# EAGLE design RoboSkinRev2 (EAGLE 9.4.2)
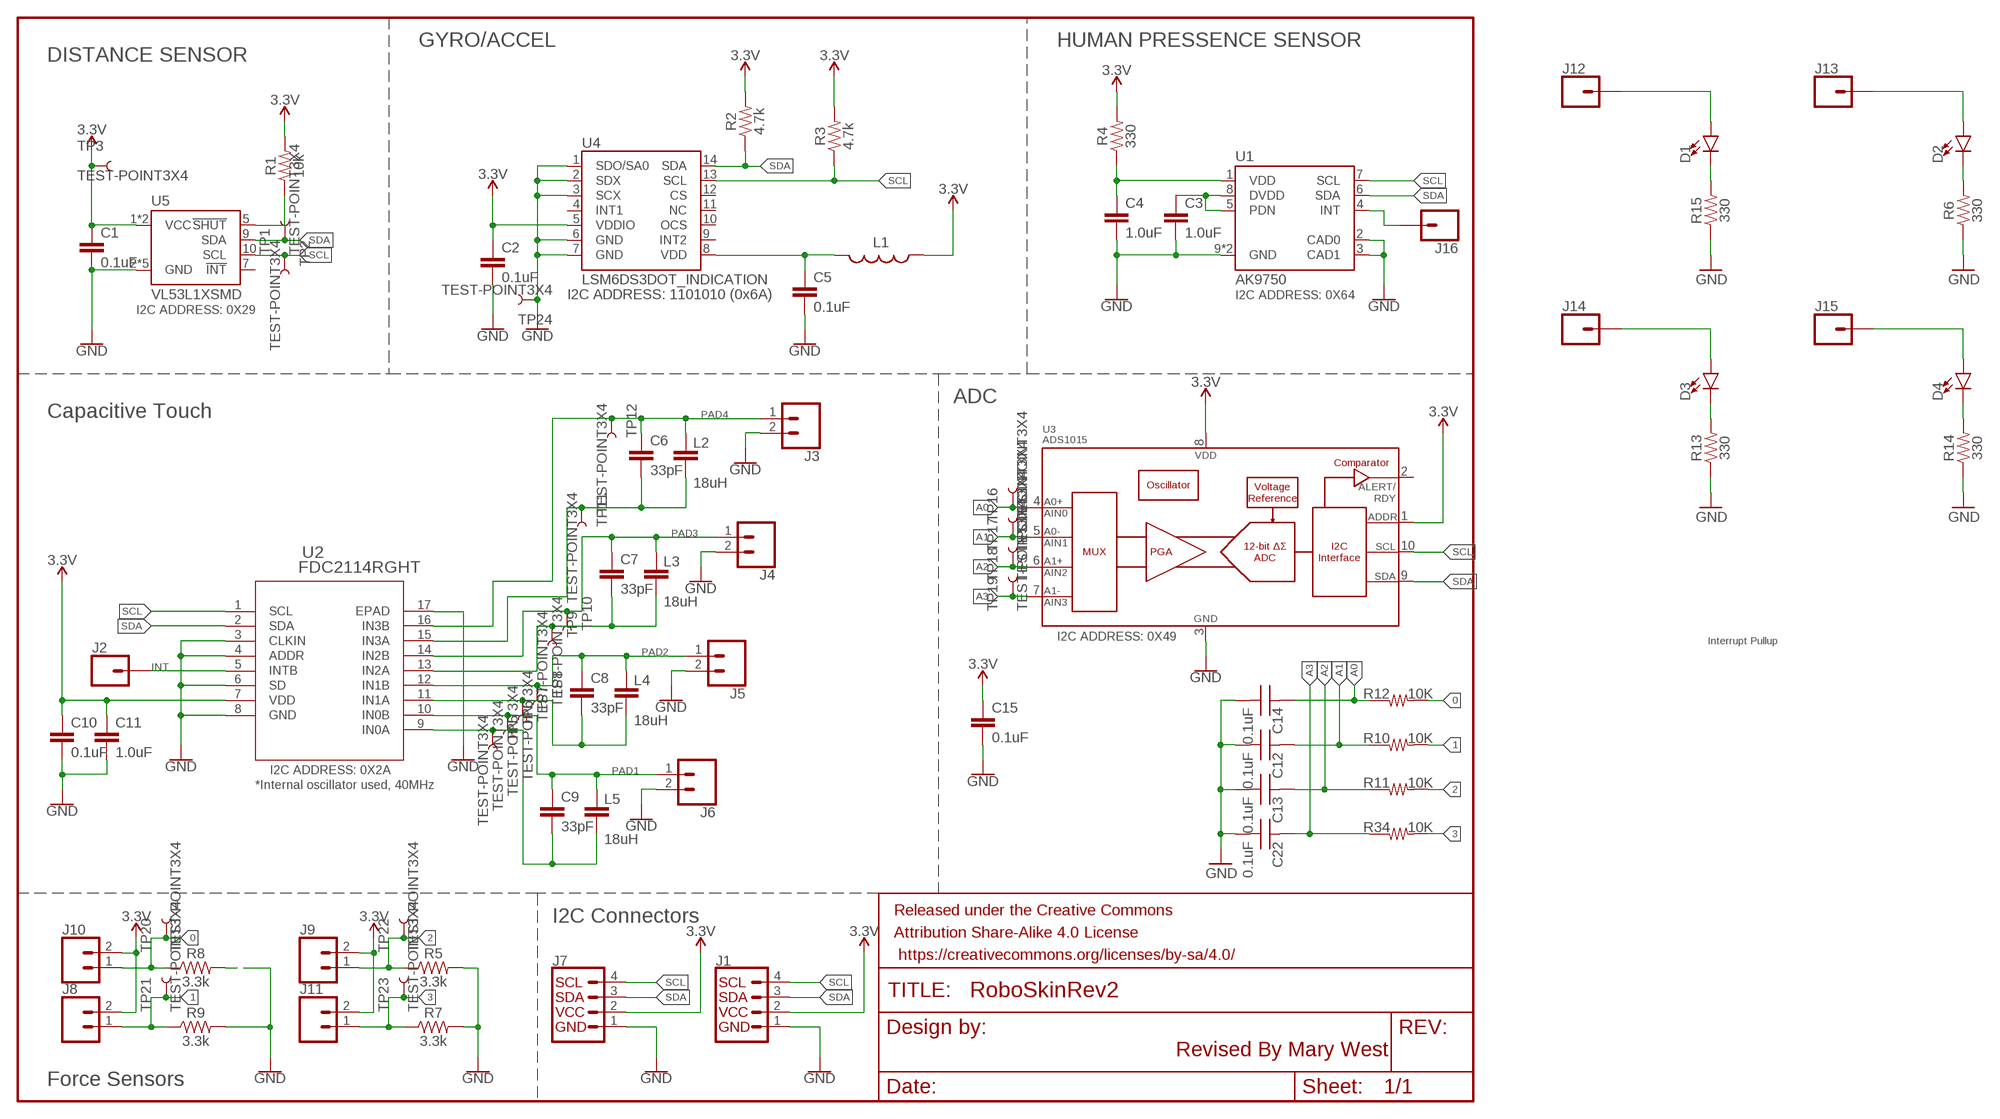
[diagram p0: schematic, sheet 1]

## Parts
C1  0.1uF  0.1UF-0603-25V-(+80/-20%)  [0603]
C2  0.1uF  0.1UF-0603-25V-(+80/-20%)  [0603]
C3  1.0uF  1.0UF-0603-16V-10%  [0603]
C4  1.0uF  1.0UF-0603-16V-10%  [0603]
C5  0.1uF  0.1UF-0603-25V-(+80/-20%)  [0603]
C6  33pF  33PF-0603-50V-5%  [0603]
C7  33pF  33PF-0603-50V-5%  [0603]
C8  33pF  33PF-0603-50V-5%  [0603]
C9  33pF  33PF-0603-50V-5%  [0603]
C10  0.1uF  0.1UF-0603-25V-(+80/-20%)  [0603]
C11  1.0uF  1.0UF-0603-16V-10%  [0603]
C12  0.1uF  CAPACITORC_0603_SILK  [0603_SILK]
C13  0.1uF  CAPACITORC_0603_SILK  [0603_SILK]
C14  0.1uF  CAPACITORC_0603_SILK  [0603_SILK]
C15  0.1uF  0.1UF-0603-25V-(+80/-20%)  [0603]
C22  0.1uF  CAPACITORC_0603_SILK  [0603_SILK]
D1  LED1206  [LED-1206]
D2  LED1206  [LED-1206]
D3  LED1206  [LED-1206]
D4  LED1206  [LED-1206]
FRAME1  FRAME-LETTERNO_PACKAGE  [DUMMY]
J1  QWIIC_CONNECTORJS-1MM  [1X04_1MM_RA]
J2  CONN_01  [1X01]
J3  CONN_02  [1X02]
J4  CONN_02  [1X02]
J5  CONN_02  [1X02]
J6  CONN_02  [1X02]
J7  QWIIC_CONNECTORJS-1MM  [1X04_1MM_RA]
J8  CONN_02  [1X02]
J9  CONN_02  [1X02]
J10  CONN_02  [1X02]
J11  CONN_02  [1X02]
J12  CONN_01  [1X01]
J13  CONN_01  [1X01]
J14  CONN_01  [1X01]
J15  CONN_01  [1X01]
J16  CONN_01PTH_NO_SILK_YES_STOP  [1X01_NO_SILK]
L1  RES-07859  INDUCTOR30OHM,1.8A  [0603]
L2  18uH  100UF6.3V20%(1210)  [1210]
L3  18uH  100UF6.3V20%(1210)  [1210]
L4  18uH  100UF6.3V20%(1210)  [1210]
L5  18uH  100UF6.3V20%(1210)  [1210]
R1  10k  10KOHM-0603-1/10W-1%  [0603]
R2  4.7k  4.7KOHM-0603-1/10W-1%  [0603]
R3  4.7k  4.7KOHM-0603-1/10W-1%  [0603]
R4  330  330OHM-0603-1/10W-1%  [0603]
R5  3.3k  3.3KOHM-0603-1/10W-1%  [0603]
R6  330  330OHM-0603-1/10W-1%  [0603]
R7  3.3k  3.3KOHM-0603-1/10W-1%  [0603]
R8  3.3k  3.3KOHM-0603-1/10W-1%  [0603]
R9  3.3k  3.3KOHM-0603-1/10W-1%  [0603]
R10  10K  RESISTORR_0603_SILK  [0603_SILK]
R11  10K  RESISTORR_0603_SILK  [0603_SILK]
R12  10K  RESISTORR_0603_SILK  [0603_SILK]
R13  330  330OHM-0603-1/10W-1%  [0603]
R14  330  330OHM-0603-1/10W-1%  [0603]
R15  330  330OHM-0603-1/10W-1%  [0603]
R34  10K  RESISTORR_0603_SILK  [0603_SILK]
TP1  TEST-POINT3X4  [PAD.03X.04]
TP2  TEST-POINT3X4  [PAD.03X.04]
TP3  TEST-POINT3X4  [PAD.03X.04]
TP5  TEST-POINT3X4  [PAD.03X.04]
TP6  TEST-POINT3X4  [PAD.03X.04]
TP7  TEST-POINT3X4  [PAD.03X.04]
TP8  TEST-POINT3X4  [PAD.03X.04]
TP9  TEST-POINT3X4  [PAD.03X.04]
TP10  TEST-POINT3X4  [PAD.03X.04]
TP11  TEST-POINT3X4  [PAD.03X.04]
TP12  TEST-POINT3X4  [PAD.03X.04]
TP16  TEST-POINT3X4  [PAD.03X.04]
TP17  TEST-POINT3X4  [PAD.03X.04]
TP18  TEST-POINT3X4  [PAD.03X.04]
TP19  TEST-POINT3X4  [PAD.03X.04]
TP20  TEST-POINT3X4  [PAD.03X.04]
TP21  TEST-POINT3X4  [PAD.03X.04]
TP22  TEST-POINT3X4  [PAD.03X.04]
TP23  TEST-POINT3X4  [PAD.03X.04]
TP24  TEST-POINT3X4  [PAD.03X.04]
U1  AK9750  [SON10]
U2  FDC2114RGHT  [RGH16]
U3  ADS1015  [MSOP10]
U4  LSM6DS3DOT_INDICATION  [LGA14L_DOT_INDICATOR]
U5  VL53L1XSMD  [VL53L1X]

## Nets
0: J10.1 R8.1 R12.P2 TP20.P$1
1: J8.1 R9.1 R10.P2 TP21.P$1
2: J9.1 R5.1 R11.P2 TP22.P$1
3: J11.1 R7.1 R34.P2 TP23.P$1
3.3V: C1.1 C2.1 C10.1 C11.1 C15.1 J1.2(VCC) J7.2(VCC) J8.2 J9.2 J10.2 J11.2 L1.1 R1.2 R2.2 R3.2 R4.2 TP3.P$1 U2.7(VDD) U3.1(ADDR) U3.8(VDD) U4.5(VDDIO) U5.1(VCC) U5.11(VCC)
A0: C14.P1 R12.P1 TP16.P$1 U3.4(AIN0)
A1: C12.P1 R10.P1 TP17.P$1 U3.5(AIN1)
A2: C13.P1 R11.P1 TP18.P$1 U3.6(AIN2)
A3: C22.P1 R34.P1 TP19.P$1 U3.7(AIN3)
D1: D2.A J13.1
D2: D3.A J14.1
D3: D4.A J15.1
D7: D1.A J12.1
GND: C1.2 C2.2 C3.2 C4.2 C5.2 C10.2 C11.2 C12.P2 C13.P2 C14.P2 C15.2 C22.P2 J1.1(GND) J3.2 J4.2 J5.2 J6.2 J7.1(GND) R5.2 R6.1 R7.2 R8.2 R9.2 R13.1 R14.1 R15.1 TP24.P$1 U1.2(CAD0) U1.3(CAD1) U1.9(GND) U1.10(GND) U2.3(CLKIN) U2.4(ADDR) U2.6(SD) U2.8(GND) U2.17(EPAD) U3.3(VSS) U4.1(SDO/SA0) U4.2(SDX) U4.3(SCX) U4.6(GND) U4.7(GND) U5.2(GND) U5.3(GND) U5.4(GND) U5.6(GND) U5.12(GND)
INT: J2.1 U2.5(INTB)
N$1: C4.1 R4.1 U1.1(VDD)
N$2: C3.1 U1.5(PDN) U1.8(DVDD)
N$3: R1.1 U5.5(!SHUT)
N$4: D1.C R15.2
N$5: D2.C R6.2
N$6: C5.1 L1.2 U4.8(VDD)
N$7: D3.C R13.2
N$8: C6.2 L2.2 TP11.P$1 U2.15(IN3A)
N$9: D4.C R14.2
N$10: C7.2 L3.2 TP9.P$1 U2.13(IN2A)
N$11: J16.1 U1.4(INT)
N$12: C8.2 L4.2 TP7.P$1 U2.11(IN1A)
N$14: C9.2 L5.2 TP5.P$1 U2.9(IN0A)
PAD1: C9.1 J6.1 L5.1 TP6.P$1 U2.10(IN0B)
PAD2: C8.1 J5.1 L4.1 TP8.P$1 U2.12(IN1B)
PAD3: C7.1 J4.1 L3.1 TP10.P$1 U2.14(IN2B)
PAD4: C6.1 J3.1 L2.1 TP12.P$1 U2.16(IN3B)
SCL: J1.4(SCL) J7.4(SCL) R3.1 TP2.P$1 U1.7(SCL) U2.1(SCL) U3.10(SCL) U4.13(SCL) U5.10(SCL)
SDA: J1.3(SDA) J7.3(SDA) R2.1 TP1.P$1 U1.6(SDA) U2.2(SDA) U3.9(SDA) U4.14(SDA) U5.9(SDA)
Unconnected: U3.2(ALERT/RDY) U4.4(INT1) U4.9(INT2) U4.10(OCS) U4.11(NC) U4.12(CS) U5.7(!INT)

## Notes on the sheet
- GYRO/ACCEL | HUMAN PRESSENCE SENSOR
- DISTANCE SENSOR
- I2C ADDRESS: 1101010 (0x6A) | I2C ADDRESS: 0X64
- I2C ADDRESS: 0X29
- ADC
- Capacitive Touch
- I2C ADDRESS: 0X49 | Interrupt Pullup
- I2C ADDRESS: 0X2A
- *Internal oscillator used, 40MHz
- I2C Connectors
- Revised By Mary West
- Force Sensors

## Library data of the parts
C1 C2 C5 C10 C15 = SparkFun-Capacitors:0.1UF: 0.1µF ceramic capacitors A capacitor is a passive two-terminal electrical component used to store electrical energy temporarily in an electric field.; PROD_ID: CAP-00810
C3 C4 C11 = SparkFun-Capacitors:1.0UF: 1µF ceramic capacitors A capacitor is a passive two-terminal electrical component used to store electrical energy temporarily in an electric field.; PROD_ID: CAP-00868
C6-C9 = SparkFun-Capacitors:33PF: 33pF ceramic capacitors A capacitor is a passive two-terminal electrical component used to store electrical energy temporarily in an electric field.; PROD_ID: CAP-10142
C12-C14 C22 = 1_BES_Passives:CAPACITOR: SMT Capacitor; PARTNO: GRM188R70J104KA01D
D1-D4 = SparkFun-LED:LED: LED (Generic) Standard schematic elements and footprints for 5mm, 3mm, 1206, and 0603 sized LEDs. Generic LEDs with no color specified.
FRAME1 = SparkFun-Aesthetics:FRAME-LETTER: Schematic Frame - Letter Standard 8.5x11 US Letter frame; DESIGNER: Nobody; VERSION: v01
J1 J7 = SparkFun-Connectors:QWIIC_CONNECTOR: SparkFun I2C Standard Qwiic Connector An SMD 1mm pitch JST connector makes it easy and quick (get it? Qwiic?) to connect I2C devices to each other. The Qwiic system <http://www.sparkfun.com/qwiic> enables fast and solderless connection between popular platforms and various sensors and actuators. We carry 200mm <https://www.sparkfun.com/products/14204>, 100mm <https://www.sparkfun.com/products/14205>, 50mm <https://www.sparkfun.com/products/14206>, and breadboard friendly <https://www.sparkfun.com/products/14207> Qwiic cables. We also offer 10 pcs strips <https://www.sparkfun.com/products/14323> the SMD connectors.
J2 J12-J16 = SparkFun-Connectors:CONN_01: Single connection point. Often used as Generic Header-pin footprint for 0.1 inch spaced/style header connections On any of the 0.1 inch spaced packages, you can populate with these: Break Away Headers - Straight <https://www.sparkfun.com/products/116> (PRT-00116) Break Away Male Headers - Right Angle <https://www.sparkfun.com/products/553> (PRT-00553) Female Headers <https://www.sparkfun.com/products/115> (PRT-00115) Break Away Headers - Machine Pin <https://www.sparkfun.com/products/117> (PRT-00117) Break Away Female Headers - Swiss Machine Pin <https://www.sparkfun.com/products/743> (PRT-00743) This device is also useful as a general connection point to wire up your design to another part of your project. Our various solder wires solder well into these plated through hole pads. Hook-Up Wire - Assortment (Stranded, 22 AWG) <https://www.sparkfun.com/products/11375> (PRT-11375) Hook-Up Wire - Assortment (Solid Core, 22 AWG) <https://www.sparkfun.com/products/11367> (PRT-11367) View the entire wire category on our website here <https://www.sparkfun.com/categories/141> Special notes: SMTSO-256-ET is a "flush mount" nut for a 4-40 screw. We mostly use this on specialty testbeds; it is a nice way to connect hardware to your PCB at an adjustable hieght. Also note, the SNAP packages are for using a snappable style connector. We sell a baggie of snaps and they are also used on two LilyPad designs: Snap Assortment - 30 pack (male and female) <https://www.sparkfun.com/products/11347> (DEV-11347) LilyPad Arduino SimpleSnap <https://www.sparkfun.com/products/10941> (DEV-10941) LilyPad SimpleSnap Protoboard <https://www.sparkfun.com/products/10940> (DEV-10940)
J3-J6 J8-J11 = SparkFun-Connectors:CONN_02: Multi connection point. Often used as Generic Header-pin footprint for 0.1 inch spaced/style header connections On any of the 0.1 inch spaced packages, you can populate with these: Break Away Headers - Straight <https://www.sparkfun.com/products/116> (PRT-00116) Break Away Male Headers - Right Angle <https://www.sparkfun.com/products/553> (PRT-00553) Female Headers <https://www.sparkfun.com/products/115> (PRT-00115) Break Away Headers - Machine Pin <https://www.sparkfun.com/products/117> (PRT-00117) Break Away Female Headers - Swiss Machine Pin <https://www.sparkfun.com/products/743> (PRT-00743) For SCREWTERMINALS and SPRING TERMINALS visit here: Screw Terimnals on SparkFun.com <https://www.sparkfun.com/search/results?term=Screw+Terminals> (5mm/3.5mm/2.54mm spacing) This device is also useful as a general connection point to wire up your design to another part of your project. Our various solder wires solder well into these plated through hole pads. Hook-Up Wire - Assortment (Stranded, 22 AWG) <https://www.sparkfun.com/products/11375> (PRT-11375) Hook-Up Wire - Assortment (Solid Core, 22 AWG) <https://www.sparkfun.com/products/11367> (PRT-11367) View the entire wire category on our website here <https://www.sparkfun.com/categories/141> Special notes: Molex polarized connector foot print use with: PRT-08233 with associated crimp pins and housings. 2.54_SCREWTERM for use with PRT-10571. 3.5mm Screw Terminal footprints for PRT-08084 5mm Screw Terminal footprints for use with PRT-08432
L1 = SparkFun-Passives:INDUCTOR: Inductors Basic Inductor/Choke - 0603 and 1206. Footprints are not proven and vary greatly between part numbers. SRN6045- 33uH, 20% 1.4A SDR0403-560KL - 56uH, 10%, 500mA RMS/740mA peak; PROD_ID: RES-07859
L2-L5 = SparkFun-Retired:100UF6.3V20%(1210): CAP-09827; PROD_ID: CAP-09827; VALUE: 100uF
R1 = SparkFun-Resistors:10KOHM: 10kΩ resistor A resistor is a passive two-terminal electrical component that implements electrical resistance as a circuit element. Resistors act to reduce current flow, and, at the same time, act to lower voltage levels within circuits. - Wikipedia; PROD_ID: RES-00824
R2 R3 = SparkFun-Resistors:4.7KOHM: 4.7kΩ resistor A resistor is a passive two-terminal electrical component that implements electrical resistance as a circuit element. Resistors act to reduce current flow, and, at the same time, act to lower voltage levels within circuits. - Wikipedia; PROD_ID: RES-07857
R4 R6 R13-R15 = SparkFun-Resistors:330OHM: 330Ω resistor A resistor is a passive two-terminal electrical component that implements electrical resistance as a circuit element. Resistors act to reduce current flow, and, at the same time, act to lower voltage levels within circuits. - Wikipedia; PROD_ID: RES-00818
R5 R7-R9 = SparkFun-Resistors:3.3KOHM: 3.3kΩ resistor A resistor is a passive two-terminal electrical component that implements electrical resistance as a circuit element. Resistors act to reduce current flow, and, at the same time, act to lower voltage levels within circuits. - Wikipedia; PROD_ID: RES-07851
R10-R12 R34 = 1_BES_Passives:RESISTOR: Resistor, Chip Mount, SMT; PARTNO: CR0603-FX-1002ELF
TP1-TP3 TP5-TP12 TP16-TP24 = SparkFun-Connectors:TEST-POINT: SparkFun Test Points Bare copper test points for troubleshooting or In-Circuit-Testing. These are used by our Production team for verifying production board runs using pogo-pins on test beds. SparkFun Products: SparkFun LSM9DS1 Breakout <https://www.sparkfun.com/products/13284> SparkFun PSOC <https://www.sparkfun.com/products/13714> SparkFun Load Cell Amplifier <https://www.sparkfun.com/products/13879>
U1 = SparkFun-Sensors:AK9750: AK9750/AK9753 Human Movement Sensor; PROD_ID: SEN-13737
U2 = FDC2114:FDC2114RGHT; BUILT_BY: EMA_Jessica; COPYRIGHT: Copyright (C) 2018 Accelerated Designs. All rights reserved; MANUFACTURER_PART_NUMBER: FDC2114RGHT; VENDOR: Texas Instruments
U3 = SparkFun-IC-Conversion:ADS1015: ADS1015 12-BIT ADC 12-Bit Del-Sig ADC Four single-ended inputs or two differential inputs Internal PGA I2C interface 2.0-5.5V SparkFun Products SparkFun Block for Intel Edison - ADC <https://www.sparkfun.com/products/13770> (DEV-13770); PROD_ID: IC-12270
U4 = LSM6DS3:LSM6DS3; PROD_ID: IC-12969
U5 = SparkFun-Sensors:VL53L1X: STMicroelectronics VL53L1X - 400 cm IR Laser ToF Sensor VL53L1X is a state-of-the-art ToF laser-ranging sensor, enhancing the ST FlightSense product family. It is the fastest miniature ToF sensor currently on the market with accurate ranging up to 4 m and fast ranging frequency (up to 50 Hz). Housed in a miniature and reflowable package, it integrates a single photon avalanche diode (SPAD) receiving array, a 940 nm invisible laser Class 1 emitter, physical infrared filters, and optics to achieve the best ranging performance in various ambient lighting conditions with a range of cover window options.; PROD_ID: IC-13960

## Board
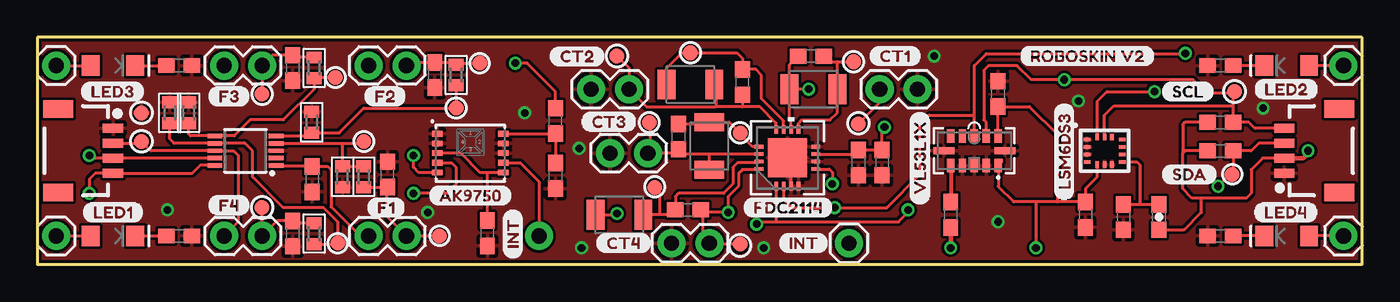
[diagram p1: board, top side]
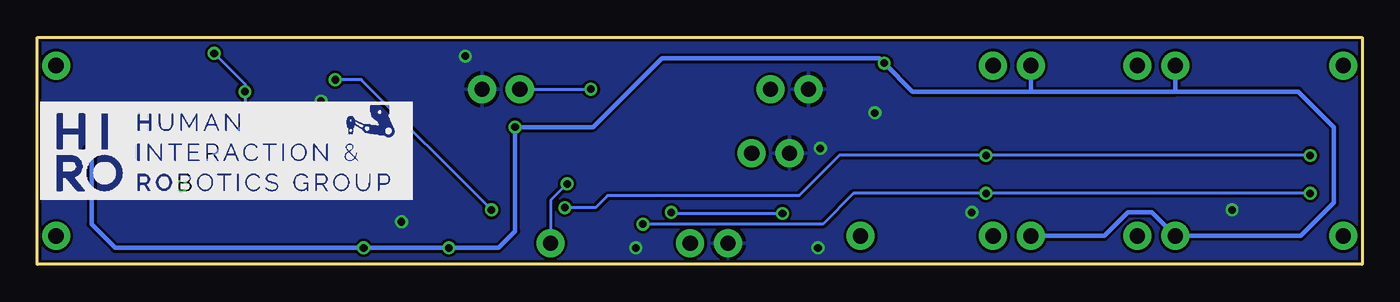
[diagram p2: board, bottom side, seen from below]

Size 88.89 x 15.23 mm. Coordinates in mm from the lower left corner, seen from the top.
Outline: 0,0 88.89,0 88.89,15.23 0,15.23 0,0
Copper layers (1*16): Top 0.035mm / dielectric 1.5mm / Bottom 0.035mm
Design rules "SparkFun-2-layer-TIGHT": minimum track width 7mil, minimum drill 15mil, track to track 7mil, track to pad 7mil, pad to pad 7mil, via to via 7mil, smd to smd 7mil, copper to edge 7mil, drill to drill 7mil, minimum pad ring 7mil, minimum via ring 7mil, stop-mask expansion 4mil, vias tented up to drill 25mil, thermal gap 10mil

### Footprints (pad centres in the part's own frame; a part is rotated, then mirrored left to right if it is on the bottom)
0603 = smd 1.1 x 1: 1 -0.85,0; 2 0.85,0
0603_SILK = smd 0.8 x 1: P1 -0.7,0; P2 0.7,0
LED-1206 = smd 1.2 x 1.4: A -1.5,0; C 1.5,0
1X04_1MM_RA = smd 0.6 x 1.35: 1 -1.5,0; 2 -0.5,0; 3 0.5,0; 4 1.5,0 | smd 1.2 x 2: NC1 2.8,-3.675; NC2 -2.8,-3.675
1X01 = drill 1.016 pad 1.88: 1 0,0
1X02 = drill 1.016 pad 1.88: 1 0,0; 2 2.54,0
1X01_NO_SILK = drill 1.016 pad 1.88: 1 0,0
1210 = smd 1.2 x 2: 1 -1.6,0; 2 1.6,0
PAD.03X.04 = smd 1.016 x 1.016: P$1 0,0
SON10 = smd 0.7 x 0.38: 1 2.225,1.3; 2 2.225,0.65; 3 2.225,0; 4 2.225,-0.65; 5 2.225,-1.3; 6 -2.225,-1.3; 7 -2.225,-0.65; 8 -2.225,0; 9 -2.225,0.65; 10 -2.225,1.3
RGH16 = smd 0.6 x 0.25: 1 -1.9,0.75; 2 -1.9,0.25; 3 -1.9,-0.25; 4 -1.9,-0.75; 9 1.9,-0.75; 10 1.9,-0.25; 11 1.9,0.25; 12 1.9,0.75 | smd 0.25 x 0.6: 5 -0.75,-1.9; 6 -0.25,-1.9; 7 0.25,-1.9; 8 0.75,-1.9; 13 0.75,1.9; 14 0.25,1.9; 15 -0.25,1.9; 16 -0.75,1.9 | smd 2.6 x 2.6: 17 0,0
MSOP10 = smd 0.3 x 1: 1 -1,-2.05; 2 -0.5,-2.05; 3 0,-2.05; 4 0.5,-2.05; 5 1,-2.05; 6 1,2.05; 7 0.5,2.05; 8 0,2.05; 9 -0.5,2.05; 10 -1,2.05
LGA14L_DOT_INDICATOR = smd 0.45 x 0.25: 1 -1.175,0.75; 2 -1.175,0.25; 3 -1.175,-0.25; 4 -1.175,-0.75; 8 1.175,-0.75; 9 1.175,-0.25; 10 1.175,0.25; 11 1.175,0.75 | smd 0.25 x 0.45: 5 -0.5,-0.925; 6 0,-0.925; 7 0.5,-0.925; 12 0.5,0.925; 13 0,0.925; 14 -0.5,0.925
VL53L1X = smd 0.5 x 0.9: 1 1.6,-1; 2 0.8,-1; 3 0,-1; 4 -0.8,-1; 5 -1.6,-1; 7 -1.6,1; 8 -0.8,1; 9 0,1; 10 0.8,1; 11 1.6,1 | smd 1.4 x 0.5: 6 -2.05,0; 12 2.05,0

### Placement (x,y rotation side)
C1  64.45,11.43 90 top
C2  70.33,3.33 270 top
C3  30.19,2.1 270 top
C4  34.77,5.94 270 top
C5  72.87,3.17 270 top
C6  43.66,3.65 180 top
C7  43.02,8.57 90 top
C8  47.31,12.22 90 top
C9  51.91,13.97 0 top
C10  55.09,6.83 270 top
C11  56.67,6.83 270 top
C12  18.41,9.53 90 top
C13  10.16,10.16 90 top
C14  20.48,5.87 270 top
C15  18.45,5.71 270 top
C22  8.89,10.16 90 top
D1  5.08,1.91 0 top
D2  83.82,13.34 180 top
D3  5.08,13.34 0 top
D4  83.82,1.91 180 top
FRAME1  45.4,1.43 90 top
J1  83.66,7.62 90 top
J2  54.45,1.43 90 top
J3  45.09,1.43 180 top
J4  40.96,7.46 180 top
J5  39.69,11.75 180 top
J6  56.52,11.75 0 top
J7  5.08,7.62 270 top
J8  24.77,13.34 180 top
J9  15.08,13.34 180 top
J10  24.77,1.91 180 top
J11  15.08,1.91 180 top
J12  1.27,1.91 0 top
J13  87.63,13.34 0 top
J14  1.27,13.34 0 top
J15  87.63,1.91 0 top
J16  33.66,1.91 0 top
L1  75.25,3.17 90 top
L2  39.05,3.33 0 top
L3  45.09,7.94 90 top
L4  43.81,12.06 180 top
L5  52.07,11.75 0 top
R1  61.28,3.33 270 top
R2  79.38,7.62 180 top
R3  79.38,9.53 180 top
R4  34.77,9.62 90 top
R5  17.14,13.18 270 top
R6  79.38,13.34 0 top
R7  17.14,2.06 270 top
R8  23.5,6.03 90 top
R9  26.67,12.7 270 top
R10  28.1,12.7 90 top
R11  18.57,13.18 90 top
R12  21.91,5.87 270 top
R13  9.53,13.34 180 top
R14  79.38,1.91 0 top
R15  9.53,1.91 180 top
R34  18.57,2.06 90 top
TP1  80.17,6.03 0 top
TP2  80.33,11.59 0 top
TP3  6.99,8.26 0 top
TP5  54.77,13.59 0 top
TP6  55.09,9.43 0 top
TP7  43.81,14.19 0 top
TP8  38.89,13.97 0 top
TP9  47.15,8.83 0 top
TP10  41.05,9.53 0 top
TP11  41.43,5.14 0 top
TP12  47.15,1.37 0 top
TP16  21.91,8.26 0 top
TP17  28.1,10.48 0 top
TP18  20,12.54 0 top
TP19  20.16,1.43 0 top
TP20  26.99,1.91 0 top
TP21  29.69,13.49 0 top
TP22  15.08,11.43 0 top
TP23  15.08,3.81 0 top
TP24  6.99,10.16 0 top
U1  29.05,7.46 0 top
U2  50.32,7.14 90 top
U3  13.97,7.62 90 top
U4  71.6,7.62 0 top
U5  62.87,7.62 0 top
U$1  [CAPTURE#PNG]  76.2,7.62 0 bottom
U$24  [AK975035]  26.22,4.62 0 top
U$25  [CT12]  55.77,13.97 0 top
U$26  [CT23]  34.34,13.95 0 top
U$27  [CT34]  36.47,9.57 0 top
U$28  [CT45]  37.47,1.43 0 top
U$29  [F16]  22.07,3.81 0 top
U$30  [F27]  21.91,11.27 0 top
U$31  [F38]  11.43,11.27 0 top
U$32  [F49]  11.43,3.97 0 top
U$34  [FDC211438]  47.31,3.81 0 top
U$36  [INT30]  49.69,1.43 0 top
U$37  [LED131]  3.02,3.49 0 top
U$38  [LED232]  81.6,11.75 0 top
U$39  [LED333]  2.86,11.59 0 top
U$40  [LED434]  81.6,3.49 0 top
U$41  [LSM6DS336]  68.9,4.29 90 top
U$42  [ROBOSKIN_V241]  65.88,13.97 0 top
U$43  [SCL39]  75.41,11.59 0 top
U$44  [SDA40]  75.41,6.03 0 top
U$45  [VL53L1X37]  59.21,3.97 90 top
U$46  [INT30]  31.91,0.32 90 top

### Tracks (layer width: path | path; a pad name or v marks a point on that pad's centre or on a via)
0
  Top 0.203: R12.P2 23.49,5.17 | 23.49,5.17 R8.1 | 23.49,5.17 23.49,3.18 J10.1 TP20.P$1
1
  Top 0.203: J8.1 24.98,13.55 R9.1 27.95,13.55 R10.P2 28.19,13.49 TP21.P$1
2
  Top 0.203: TP22.P$1 J9.1 15.77,14.03 R5.1 17.3,13.88 R11.P2
3
  Top 0.203: R34.P2 17.3,2.76 R7.1 16.09,2.91 J11.1 TP23.P$1
3.3V  (via drill 0.51)
  Top 0.203: J1.2 82.21,7.12 81.44,6.35 81.44,4.76 81.12,4.45 78.11,4.45 | 78.11,4.45 77.47,4.45 76.83,5.08 76.83,7.46 | R2.2 76.99,7.62 76.83,7.46 | L1.1 76.94,2.33 78.11,3.49 78.11,4.45 | U4.5 71.1,5.85 70.33,5.08 C2.1 68.42,4.18 | 68.42,4.18 66.99,4.18 | 66.99,4.18 65.51,4.18 64.45,5.24 64.47,5.25 U5.1 | U5.11 64.45,8.63 C1.1 66.57,10.58 68.42,8.73 68.42,4.18 | R3.2 76.99,9.53 76.83,9.37 76.83,7.46 | 66.99,4.18 v66.99,1.11 | U2.7 54.8,7.39 C10.1 C11.1 56.67,9.05 v56.83,9.21 | J7.2 6.85,8.12 TP3.P$1 7.62,7.62 U3.8 13.18,7.62 13.49,7.3 13.49,2.86 J11.2 | U3.1 18.39,6.62 C15.1 19.47,6.57 19.7,6.34 19.7,3.86 21.65,1.91 J10.2 | 34.61,10.63 R4.2 34.77,11.59 32.86,13.49 v32.07,13.49
  Top 0.305: v85.25,7.62 85.25,7.44 84.93,7.12 J1.2 | R1.2 v61.28,1.11
  Bottom 0.305: v85.25,7.62 85.25,2.7 83.66,1.11 v66.99,1.11 v61.28,1.11 57.94,1.11 56.83,2.22 v56.83,9.21 51.59,9.21 46.99,13.81 32.38,13.81 v32.07,13.49 30.16,11.59 22.23,11.59 | J10.2 17.3,1.91 15.72,3.49 14.13,3.49 J11.2 4.13,1.91 1.91,4.13 1.91,9.21 4.29,11.59 12.54,11.59 | J9.2 12.54,11.59 | 22.23,11.59 12.54,11.59 | J8.2 22.23,11.59
A0
  Top 0.203: U3.4 20.48,8.12 | 20.48,8.12 21.77,8.12 TP16.P$1 | R12.P1 C14.P1 20.48,8.12
A1
  Top 0.203: U3.5 18.21,8.62 C12.P1 20.25,8.82 21.91,10.48 TP17.P$1 R10.P1
A2
  Top 0.203: C13.P1 10.16,8.73 10.27,8.62 U3.6 13.22,8.62 14.29,9.68 16.51,9.68 18.57,11.75 R11.P1 18.64,12.54 TP18.P$1
A3
  Top 0.203: C22.P1 8.89,8.41 9.18,8.12 U3.7 13.95,8.12 14.45,7.62 14.45,5.87 16.51,3.81 19.21,3.81 20.16,2.86 TP19.P$1 20.1,1.36 R34.P1
D1
  Top 0.203: J13.1 D2.A
D2
  Top 0.203: J14.1 D3.A
D3
  Top 0.203: J15.1 D4.A
D7
  Top 0.203: J12.1 D1.A
GND  (via drill 0.51)
  Top 0.203: C22.P2 C13.P2 | U2.3 50.57,6.89 U2.17
  other vias: 8.73,3.65 26.19,3.49 36.51,1.11 32.7,10.16 36.35,7.78 48.74,1.11 60.17,13.97 64.45,2.86 82.23,10.48 69.85,10.95
  pour Bottom: 0,15.24 0,0 88.9,0 88.9,15.24
  pour Top: 0,0 0,15.24 88.9,15.24 88.9,0
INT  (via drill 0.51)
  Top 0.203: U2.5 53.14,6.39 53.34,6.19 v53.34,5.4
  Bottom 0.203: v53.34,5.4 54.45,4.29 J2.1
N$1
  Top 0.203: C4.1 R4.1 34.76,8.76 U1.1
N$2
  Top 0.203: U1.8 28.42,7.46 29.72,6.16 30.16,6.16 | U1.5 30.16,6.16 | 30.16,6.16 30.16,2.98 C3.1
N$3
  Top 0.254: U5.5 61.28,6.61 R1.1
N$4
  Top 0.203: D1.C R15.2
N$5
  Top 0.203: D2.C R6.2
N$6
  Top 0.203: C5.1 73.98,4.03 | 73.98,4.03 L1.2 | U4.8 73.78,6.87 73.98,6.67 73.98,4.03
N$7
  Top 0.203: D3.C R13.2
N$8
  Top 0.203: 41.44,5.14 TP11.P$1 41.75,4.83 41.75,3.33 | 41.75,3.33 42.49,3.33 C6.2 42.81,4.55 43.02,4.76 46.04,4.76 46.67,5.4 46.67,6.51 46.99,6.83 48.36,6.83 U2.15 | 41.75,3.33 L2.2
N$9
  Top 0.203: D4.C R14.2
N$10
  Top 0.203: U2.13 47.99,7.89 47.39,8.49 47.39,8.59 TP9.P$1 46.44,9.54 L3.2 44.97,9.42 C7.2 43.07,9.47 43.18,9.37
N$11
  Top 0.203: U1.4 32.4,6.81 33.66,5.56 J16.1
N$12
  Top 0.203: U2.11 50.07,9.62 48.58,11.11 48.58,12.7 48.2,13.07 C8.2 47.31,13.81 46.93,14.19 TP7.P$1 43.24,14.19 42.22,13.16 L4.2
N$14
  Top 0.203: C9.2 53.14,13.59 53.66,13.59 | 53.66,13.59 TP5.P$1 | U2.9 51.07,9.48 51.28,9.68 53.18,9.68 53.67,10.17 L5.2 53.67,13.58 53.66,13.59
PAD1  (via drill 0.51)
  Top 0.203: U2.10 50.57,9.68 | 50.57,9.68 50.57,9.78 | TP6.P$1 56.52,10.86 J6.1 | L5.1 50.47,13.38 C9.1 | 50.57,9.68 50.47,9.79 L5.1 | v51.75,11.75 L5.1
  Bottom 0.203: J6.1 v51.75,11.75
PAD2
  Top 0.203: U2.12 49.57,9.48 48.5,10.56 47.31,10.56 | TP8.P$1 39.69,13.18 J5.1 40.88,10.56 45.48,10.56 | 45.48,10.56 45.56,10.64 45.56,11.92 45.49,11.99 | 45.49,11.99 L4.1 | 45.56,12.06 45.49,11.99 | 47.31,10.56 45.48,10.56 | C8.1 47.31,10.56
PAD3
  Top 0.203: 41.12,7.46 42.76,7.46 C7.1 43.35,7.39 45.09,7.39 | 41.12,7.46 J4.1 | TP10.P$1 41.12,9.46 41.12,7.46 | U2.14 45.09,7.39 | L3.1 45.09,7.39
PAD4  (via drill 0.51)
  Top 0.203: 45.56,1.43 45.24,1.43 | 45.24,1.43 J3.1 44.66,1.85 44.66,3.49 | TP12.P$1 45.31,1.36 45.24,1.43 | L2.1 38.89,3.33 v38.89,3.41 | 44.66,3.49 v46.35,3.49 46.35,4.54 47.05,5.24 47.05,6.1 47.31,6.35 48.38,6.35 U2.16 | 44.66,3.49 C6.1
  Bottom 0.203: v38.89,3.41 46.27,3.41 v46.35,3.49
SCL  (via drill 0.51)
  Top 0.203: J1.4 81.69,9.12 81.28,9.53 R3.1 80.22,10.64 | 80.22,10.64 80.22,11.49 | 80.22,11.49 TP2.P$1 | U4.13 71.6,10 72.23,10.64 80.22,10.64 | U5.10 63.66,9.53 63.5,9.68 63.5,13.02 63.82,13.34 65.72,13.34 66.67,12.38 v68.9,12.38 77.53,12.38 78.42,11.49 80.22,11.49 | 49.53,2.86 48.42,2.86 v48.26,2.7 | 49.53,2.86 57.78,2.86 58.42,3.49 v58.42,3.65 | U3.10 11.87,6.67 10.95,6.67 10.41,6.12 J7.4 3.9,6.12 3.49,5.71 v3.49,4.76 | 49.53,2.86 49.57,2.9 U2.1 | U1.7 27.8,6.81 28.1,6.51 28.1,5.4 27.46,4.76 v25.24,4.76
  Bottom 0.203: v58.42,3.65 67.15,12.38 v68.9,12.38 | v3.49,4.76 v25.24,4.76 34.13,4.76 36.2,2.7 v48.26,2.7
SDA  (via drill 0.51)
  Top 0.203: J1.3 81.94,8.12 81.44,7.62 R2.1 80.22,6.09 | 80.22,6.09 TP1.P$1 | U4.14 71.12,8.57 71.12,10.95 71.75,11.59 v74.96,11.59 | U5.9 62.87,10 | 62.87,10 62.87,13.34 63.66,14.13 76.99,14.13 v77.02,14.15 | v79.22,5.24 80.07,6.09 80.22,6.09 | U2.2 50.07,4.38 50.64,3.81 v53.5,3.81 56.99,3.81 59.21,6.03 59.21,9.37 59.85,10 62.87,10 | U3.9 J7.3 3.67,7.12 v3.49,7.3 | U1.6 25.59,6.16 25.24,6.51 v25.24,7.3
  Bottom 0.203: v77.02,14.15 74.96,12.09 v74.96,11.59 74.96,9.5 v79.22,5.24 | v3.49,7.3 v25.24,7.3 35.08,7.3 37.78,4.6 50.64,4.6 51.44,3.81 v53.5,3.81